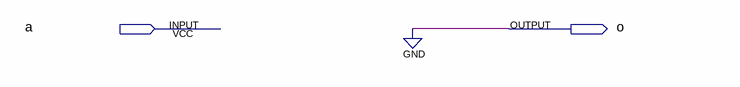
[diagram p0: schematic sheet]
// Quartus schematic LOG_SR1.bdf as structural Verilog: 0 symbols, 2 pins
module LOG_SR1 (
  input  a,
  output o
);


  assign o = 1'b0;
endmodule
